# EAGLE design lesson3 (EAGLE 8.2.0)
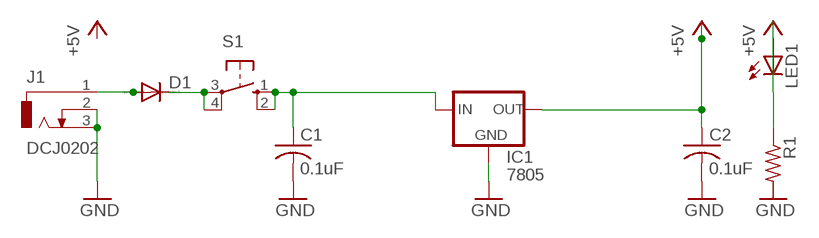
[diagram p0: schematic, sheet 1]

## Parts
C1  0.1uF  C-US025-030X050  [C025-030X050]
C2  0.1uF  C-US025-030X050  [C025-030X050]
D1  DIODE-D-7.5  [D-7.5]
IC1  7805  78XXL  [78XXL]
J1  DCJ0202  [DCJ0202]
LED1  LED5MM  [LED5MM]
R1  R-US_0204/5  [0204/5]
S1  10-XX  [B3F-10XX]

## Nets
+5V: C2.1 IC1.OUT
GND: C1.2 C2.2 IC1.GND J1.2 J1.3 R1.2
N$1: C1.1 IC1.IN S1.1(S) S1.2(S1)
N$2: LED1.K(C) R1.1
N$3: D1.A J1.1
N$4: D1.C S1.3(P) S1.4(P1)
Unconnected: LED1.A

## Library data of the parts
C1 C2 = rcl:C-US: CAPACITOR, American symbol
D1 = diode:DIODE-: DIODE
IC1 = v-reg:78XXL: VOLTAGE REGULATOR
J1 = con-jack:DCJ0202: DC POWER JACK Source: DCJ0202.pdf; OC_FARNELL: unknown; OC_NEWARK: unknown
LED1 = led:LED: LED OSRAM: - CHIPLED LG R971, LG N971, LY N971, LG Q971, LY Q971, LO R971, LY R971 LH N974, LH R974 LS Q976, LO Q976, LY Q976 LO Q996 - Hyper CHIPLED LW Q18S LB Q993, LB Q99A, LB R99A - SideLED LS A670, LO A670, LY A670, LG A670, LP A670 LB A673, LV A673, LT A673, LW A673 LH A674 LY A675 LS A676, LA A676, LO A676, LY A676, LW A676 LS A679, LY A679, LG A679 - Hyper Micro SIDELED® LS Y876, LA Y876, LO Y876, LY Y876 LT Y87S - SmartLED LW L88C, LW L88S LB L89C, LB L89S, LG L890 LS L89K, LO L89K, LY L89K LS L896, LA L896, LO L896, LY L896 - TOPLED LS T670, LO T670, LY T670, LG T670, LP T670 LSG T670, LSP T670, LSY T670, LOP T670, LYG T670 LG T671, LOG T671, LSG T671 LB T673, LV T673, LT T673, LW T673 LH T674 LS T676, LA T676, LO T676, LY T676, LB T676, LH T676, LSB T676, LW T676 LB T67C, LV T67C, LT T67C, LS T67K, LO T67K, LY T67K, LW E67C LS E67B, LA E67B, LO E67B, LY E67B, LB E67C, LV E67C, LT E67C LW T67C LS T679, LY T679, LG T679 LS T770, LO T770, LY T770, LG T770, LP T770 LB T773, LV T773, LT T773, LW T773 LH T774 LS E675, LA E675, LY E675, LS T675 LS T776, LA T776, LO T776, LY T776, LB T776 LHGB T686 LT T68C, LB T68C - Hyper Mini TOPLED® LB M676 - Mini TOPLED Santana® LG M470 LS M47K, LO M47K, LY M47K Source: http://www.osram.convergy.de LUXEON: - LUMILED® LXK2-PW12-R00, LXK2-PW12-S00, LXK2-PW14-U00, LXK2-PW14-V00 LXK2-PM12-R00, LXK2-PM12-S00, LXK2-PM14-U00 LXK2-PE12-Q00, LXK2-PE12-R00, LXK2-PE12-S00, LXK2-PE14-T00, LXK2-PE14-U00 LXK2-PB12-K00, LXK2-PB12-L00, LXK2-PB12-M00, LXK2-PB14-N00, LXK2-PB14-P00, LXK2-PB14-Q00 LXK2-PR12-L00, LXK2-PR12-M00, LXK2-PR14-Q00, LXK2-PR14-R00 LXK2-PD12-Q00, LXK2-PD12-R00, LXK2-PD12-S00 LXK2-PH12-R00, LXK2-PH12-S00 LXK2-PL12-P00, LXK2-PL12-Q00, LXK2-PL12-R00 Source: www.luxeon.com KINGBRIGHT: KA-3528ASYC Source: www.kingbright.com
R1 = rcl:R-US_: RESISTOR, American symbol
S1 = switch-omron:10-XX: OMRON SWITCH; MPN: B3F-1000; OC_FARNELL: 176432; OC_NEWARK: 36M3542

## Board
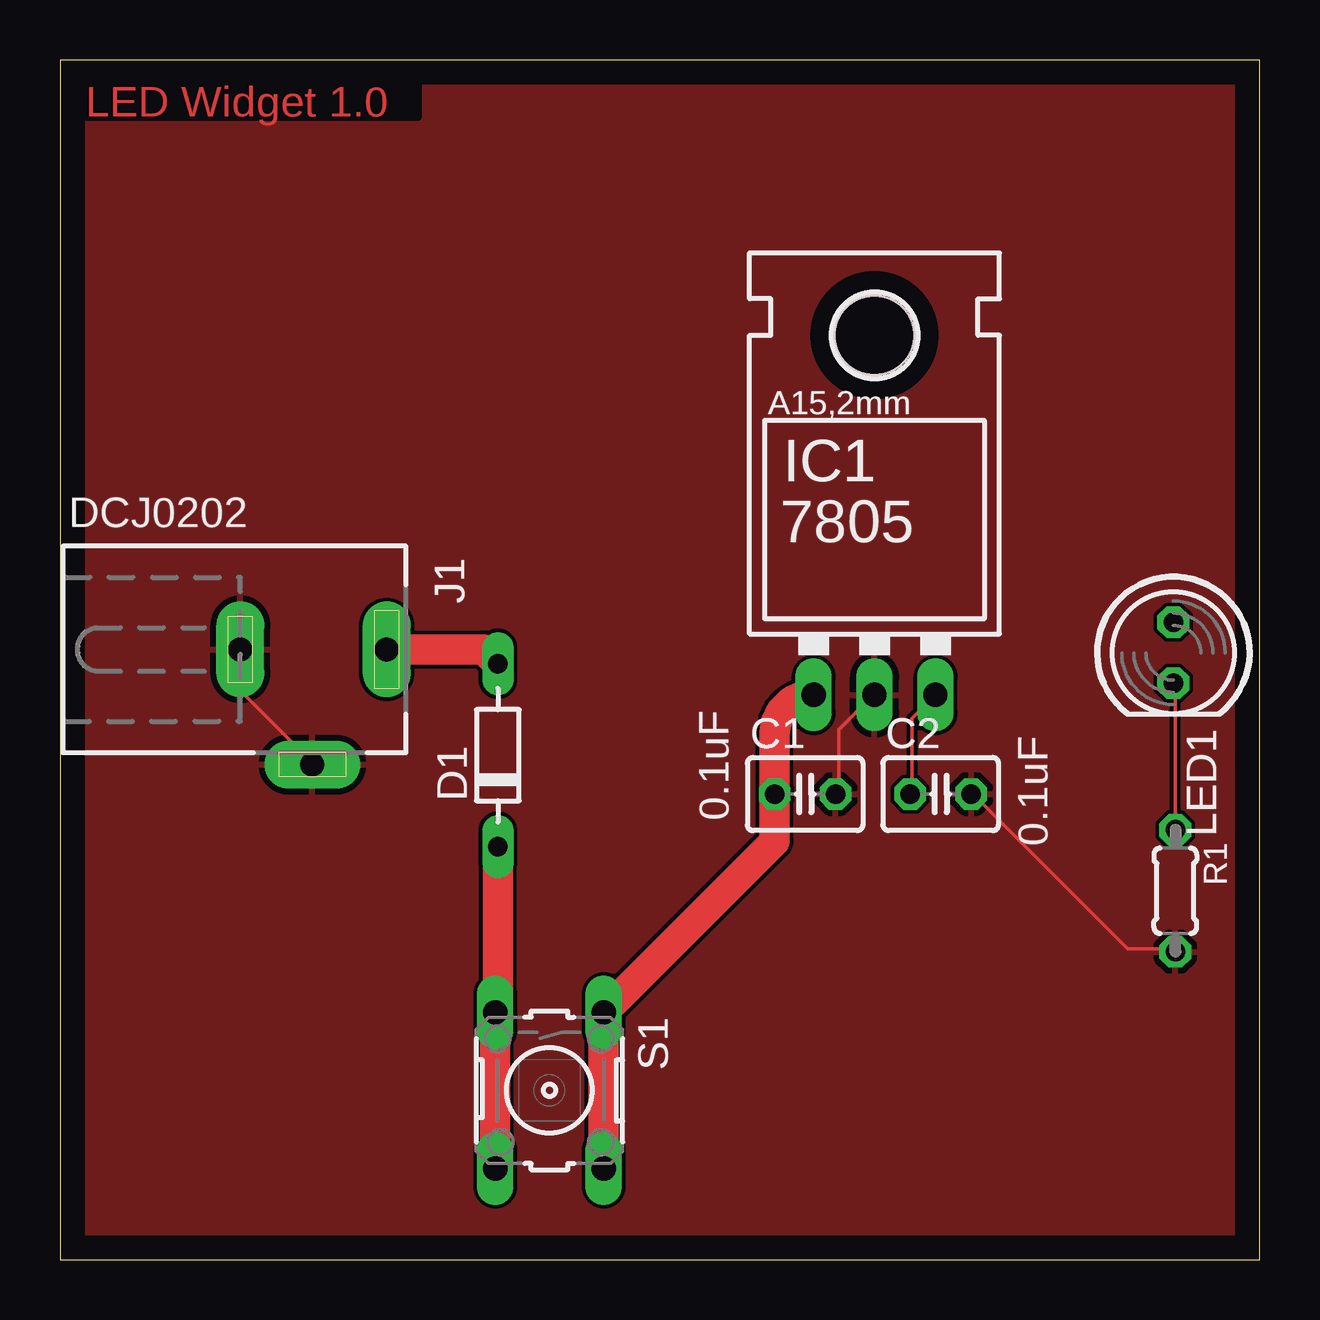
[diagram p1: board, top side]
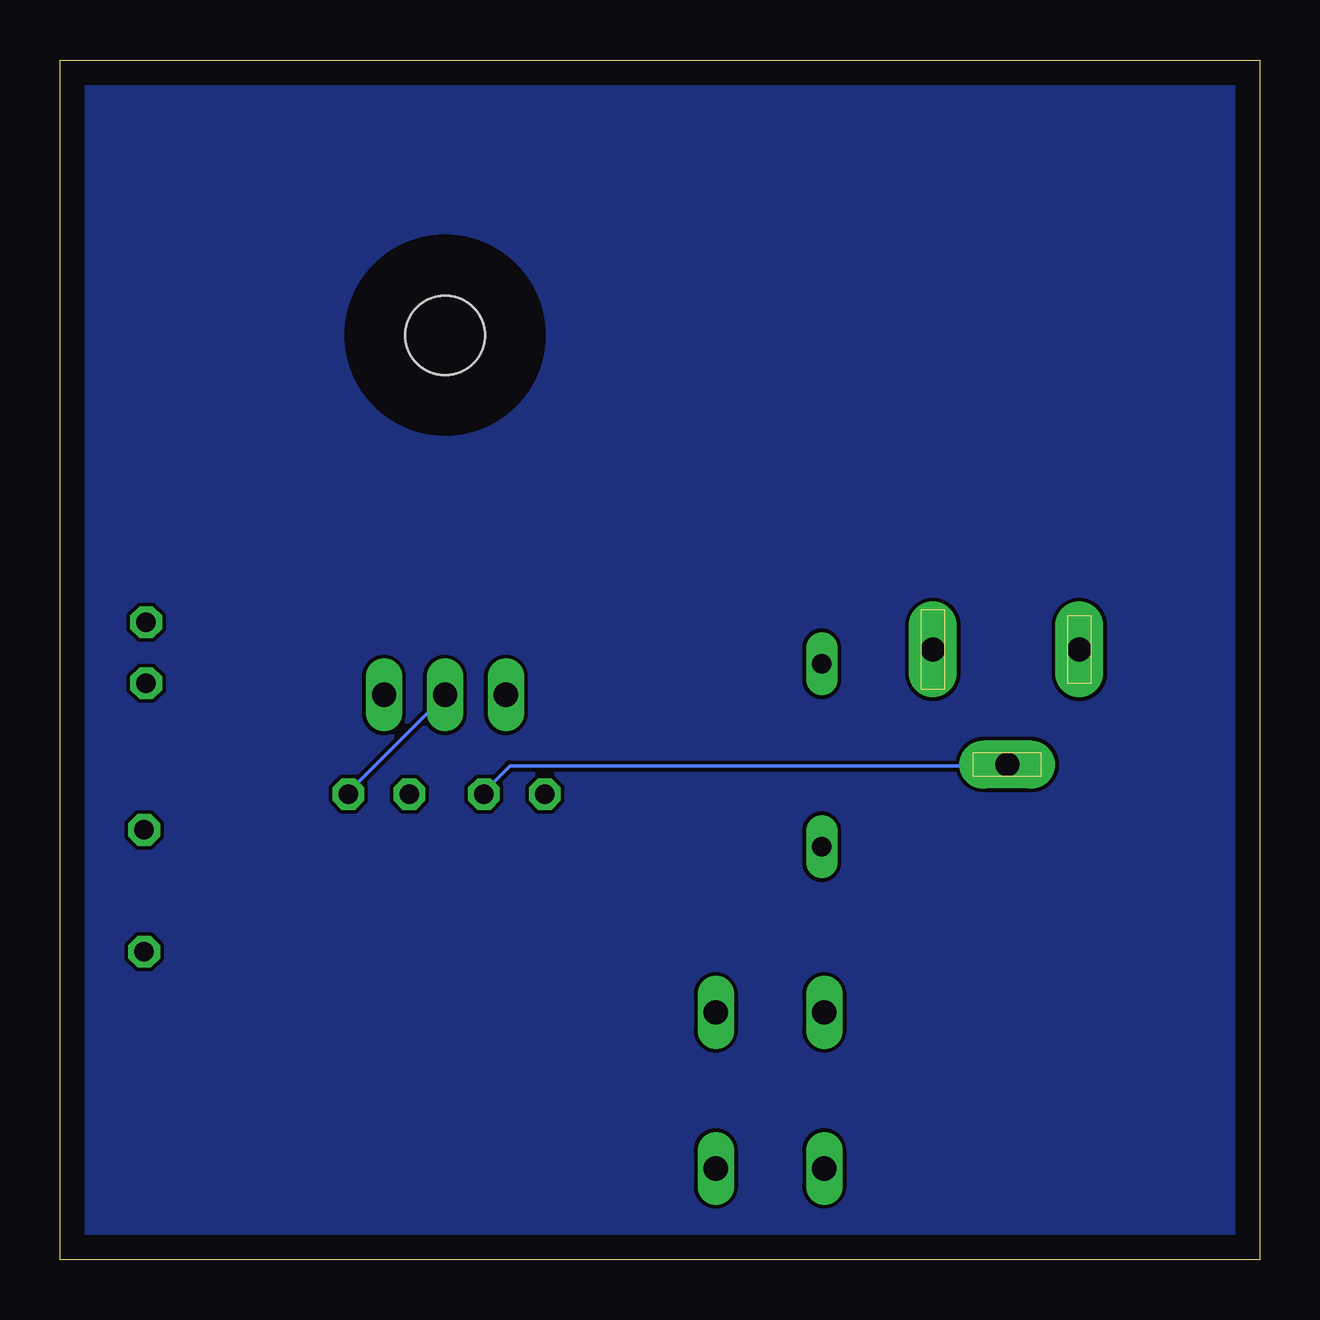
[diagram p2: board, bottom side, seen from below]

Size 50 x 50 mm. Coordinates in mm from the lower left corner, seen from the top.
Outline: 0,0 50,0 50,50 0,50 0,0
Copper layers (1*16): Top 0.035mm / dielectric 1.5mm / Bottom 0.035mm
Design rules "default": minimum track width 6mil, minimum drill 0.35mm, track to track 6mil, track to pad 6mil, pad to pad 6mil, via to via 6mil, smd to smd 6mil, copper to edge 40mil, drill to drill 6mil, minimum pad ring 10mil, minimum via ring 8mil, stop-mask expansion 4mil, vias tented up to drill 0mil, thermal gap 10mil

### Footprints (pad centres in the part's own frame; a part is rotated, then mirrored left to right if it is on the bottom)
C025-030X050 = drill 0.813 octagon: 1 -1.27,0; 2 1.27,0
D-7.5 = drill 0.813 long: A 3.81,0; C -3.81,0
78XXL = drill 1.016 long: GND 0,-3.81; IN -2.54,-3.81; OUT 2.54,-3.81 | hole 3.302: 0,11.176
DCJ0202 = drill 1 pad 2 long: 1 0,3.1; 2 4.8,0; 3 0,-3
LED5MM = drill 0.813 octagon: A -1.27,0; K 1.27,0
0204/5 = drill 0.813 octagon: 1 -2.54,0; 2 2.54,0
B3F-10XX = drill 1.016 long: 1 -3.251,2.261; 2 3.251,2.261; 3 -3.251,-2.261; 4 3.251,-2.261

### Placement (x,y rotation side)
C1  31.06,19.4 0 top
C2  36.71,19.4 0 top
D1  18.25,21.02 90 top
IC1  33.95,27.35 0 top
J1  10.52,25.43 270 top
LED1  46.41,25.29 270 top
R1  46.49,15.37 270 top
S1  20.4,7.05 270 top

### Tracks (layer width: path | path; a pad name or v marks a point on that pad's centre or on a via)
+5V
  Top 0.152: C2.1 35.51,19.51 35.51,22.55 36.42,23.47 IC1.OUT
GND
  Top 0.152: J1.3 7.62,25.3 7.62,23.62 10.52,20.73 J1.2 | C1.2 32.46,19.51 32.46,22.1 33.83,23.47 IC1.GND | R1.2 46.48,12.95 44.5,12.95 38.1,19.36 C2.2
  Bottom 0.152: C2.2 37.95,19.51 33.98,23.47 IC1.GND | J1.2 10.67,20.57 31.24,20.57 32.31,19.51 C1.2
  pour Top: 0,49.96 49.96,49.96 49.96,0 0,0
N$1
  Top 1.27: S1.2 S1.1 29.79,17.43 C1.1 29.79,21.92 arc-90 IC1.IN
N$2
  Top 0.152: LED1.K 46.48,23.93 46.48,17.98 R1.1
N$3
  Top 1.27: J1.1 17.65,25.43 D1.A
N$4
  Top 1.27: D1.C 18.25,10.41 S1.3 S1.4
N$5
  pour Bottom: 0,49.96 49.78,49.96 49.96,49.78 49.96,0.18 50.14,0 0,0

### Text on the board
Top: LED Widget 1.0
_tsilk: A15,2mm | IC1 | DCJ0202 | 7805 | J1 | LED1 | C1 | C2 | D1 | 0.1uF | 0.1uF | R1 | S1